# Altium schematic sheet Arduino_Uno_v1_schematic.SchDoc
size B; PageSetup: Record=PageOptions|CenterHorizontal=True|CenterVertical=True|PrintScale=1.54|XCorrection=1.00|YCorrection=1.00|PrintKind=1|BorderSize=5000000|LeftOffset=0|BottomOffset=0|Orientation=2|PaperLength=1000|PaperWidth=1000|Scale=100|PaperSource=7|PrintQuality=-3|MediaType=1|DitherType=10|PrintScaleMode=1|PaperKind=A3|PaperIndex=8
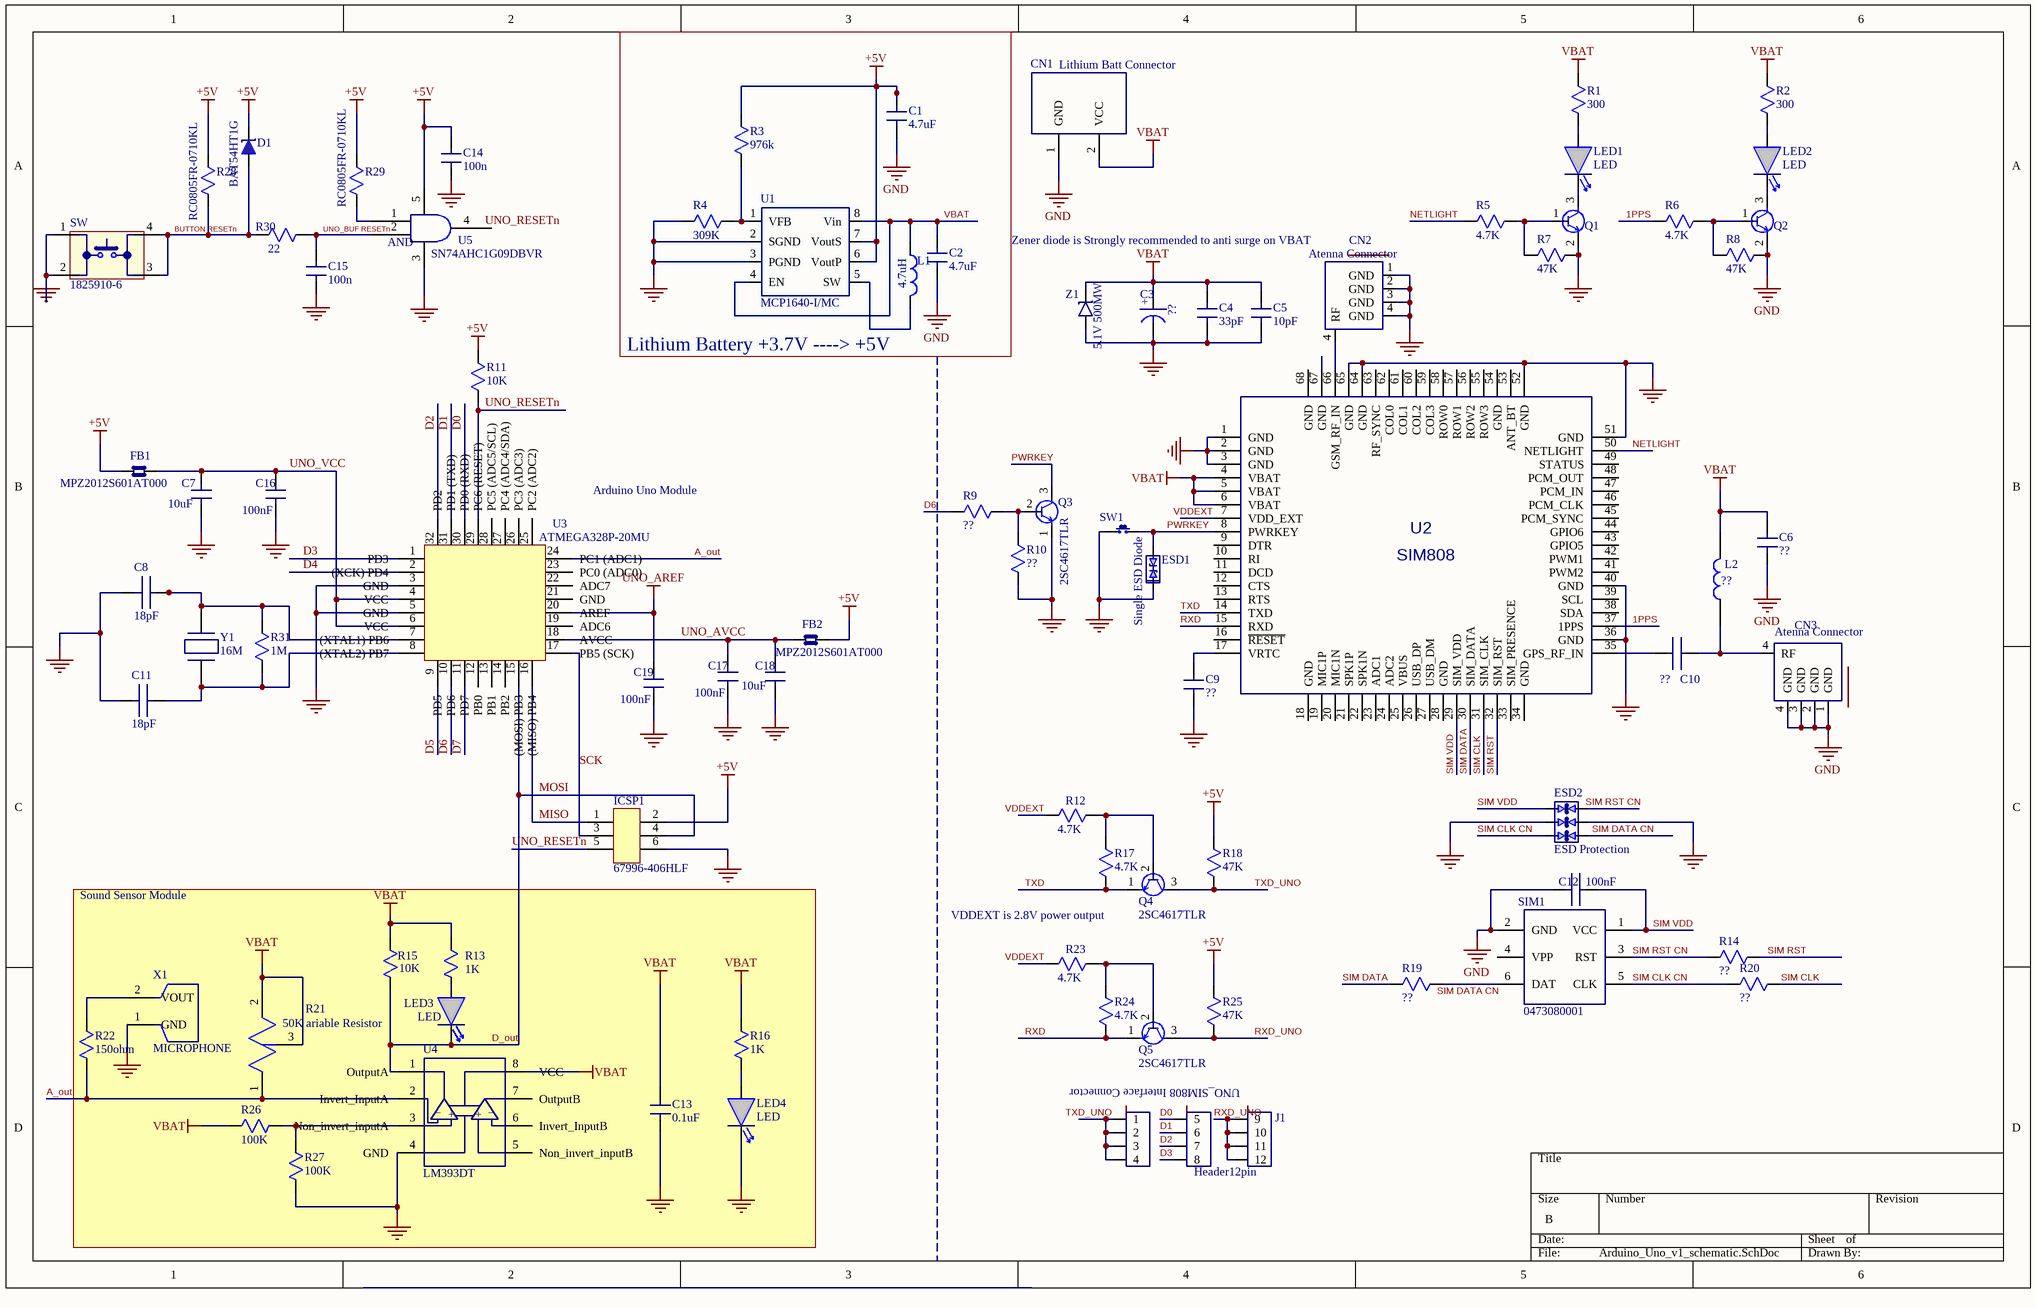
[diagram p0: Arduino_Uno_v1_schematic.SchDoc]

## Parts
C1  4.7uF
C2  4.7uF
C3  ??
C4  33pF
C5  10pF
C6  ??
C7  10uF
C8  18pF
C9  ??
C10  ??
C11  18pF
C12  100nF
C13  0.1uF
C14  100n
C15  100n
C16  100nF
C17  100nF
C18  10uF
C19  100nF
CN1  Lithium Batt Connector
CN2  Atenna Connector
CN3  Atenna Connector
D1  BAT54HT1G
ESD1  Single ESD Diode
ESD2  ESD Protection
FB1  MPZ2012S601AT000
FB2  MPZ2012S601AT000
ICSP1  67996-406HLF
J1  Header12pin
L1  4.7uH
L2  ??
LED1  LED
LED2  LED
LED3  LED
LED4  LED
Q1  TRANS NPN  (value not drawn)
Q2  TRANS NPN  (value not drawn)
Q3  2SC4617TLR
Q4  2SC4617TLR
Q5  2SC4617TLR
R1  300
R2  300
R3  976k
R4  309K
R5  4.7K
R6  4.7K
R7  47K
R8  47K
R9  ??
R10  ??
R11  10K
R12  4.7K
R13  1K
R14  ??
R15  10K
R16  1K
R17  4.7K
R18  47K
R19  ??
R20  ??
R21  50K ariable Resistor
R22  150ohm
R23  4.7K
R24  4.7K
R25  47K
R26  100K
R27  100K
R28  RC0805FR-0710KL
R29  RC0805FR-0710KL
R30  22
R31  1M
SIM1  0473080001
SW  1825910-6
SW1  SWITCH  (value not drawn)
U1  MCP1640-I/MC
U2  SIM808  [QFN100P2400X2400X260-68N]
U3  ATMEGA328P-20MU
U4  LM393DT
U5  SN74AHC1G09DBVR
X1  MICROPHONE
Y1  16M
Z1  5.1V 500MW

## Blocks framed on the sheet
Lithium Battery +3.7V ----> +5V: C1 C2 L1 R3 R4 U1
Sound Sensor Module: C13 LED3 LED4 R13 R15 R16 R21 R22 R26 R27 U4 X1

## Nets
+5V: C1.2 C14.2 D1.1(Cathode) FB1.1 FB2.1 ICSP1.2 R3.2 R11.1 R18.2 R25.2 R28.2 R29.2 U1.6(VoutP) U1.7(VoutS) U5.5
GND: C1.1 C2.1 C3.1 C4.1 C5.1 C6.1 C7.2 C8.1 C9.2 C11.1 C12.1 C13.1 C14.1 C15.1 C16.2 C17.2 C18.2 C19.2 CN1.1(GND) CN2.1(GND) CN2.2(GND) CN2.3(GND) CN2.4(GND) CN3.1(GND) CN3.2(GND) CN3.3(GND) CN3.4(GND) ESD1.1 ESD2.2 ESD2.5 ICSP1.6 LED4.2 Q1.2 Q2.2 Q3.1 R4.1 R7.2 R8.2 R10.2 R27.2 SIM1.2(GND) SW.1 SW.2 SW1.1 U1.2(SGND) U1.3(PGND) U2.1(GND) U2.2(GND) U2.3(GND) U2.36(GND) U2.40(GND) U2.51(GND) U2.52(GND) U2.64(GND) U2.65(GND) U5.3 X1.1(GND) Z1.1
UNO_AREF: C19.1
VBAT: C2.2 C3.2 C4.2 C5.2 C6.2 C13.2 CN1.2(VCC) L1.1 L2.1 R1.2 R2.2 R13.1 R15.1 R16.1 R21.2 R21.3 R26.1 U1.4(EN) U1.8(Vin) U2.4(VBAT) U2.5(VBAT) U2.6(VBAT) Z1.1
1PPS: R6.1 U2.37(1PPS)
A_out: R21.1 R22.2
BUTTON RESETn: D1.2(Anode) R28.1 R30.1 SW.3 SW.4
D0: J1.5
D1: J1.6
D2: J1.7
D3: J1.8
D6: R9.2
D_out: ICSP1.4 LED3.2 R15.2  [also labelled MOSI]
MISO: ICSP1.1(MISO)
NETLIGHT: R5.1 U2.50(NETLIGHT)
PWRKEY: ESD1.2 Q3.3 SW1.1 U2.8(PWRKEY)
RXD: Q5.1 R24.1 U2.15(RXD)
RXD_UNO: J1.9 J1.10 J1.11 J1.12 Q5.3 R25.1
SCK: ICSP1.3
SIM CLK: R20.1 U2.31(SIM_CLK)
SIM CLK CN: ESD2.6 R20.2 SIM1.5(CLK)
SIM DATA: R19.2 U2.30(SIM_DATA)
SIM DATA CN: ESD2.1
SIM RST: R14.1 U2.32(SIM_RST)
SIM RST CN: R14.2 SIM1.3(RST)
SIM VDD: C12.2 ESD2.4 SIM1.1(VCC) U2.29(SIM_VDD)
TXD: Q4.1 R17.1 U2.14(TXD)
TXD_UNO: Q4.3 R18.1
UNO_AVCC: C17.1 C18.1 FB2.2
UNO_BUF RESETn: C15.2 R30.2 U5.2
UNO_RESETn: ICSP1.5 R11.2
UNO_VCC: C7.1 C16.1 FB1.2
NetC8_2: C8.2 R31.2 Y1.1
NetC9_1: C9.1 U2.17(VRTC)
NetC10_1: C10.1 U2.35(GPS_RF_IN)
NetC10_2: C10.2 CN3.4(RF) L2.1
NetC11_2: C11.2 R31.1 Y1.2
NetCN2_4: CN2.4(RF) U2.66(GSM_RF_IN)
NetJ1_1: J1.1 J1.2 J1.3 J1.4
NetL1_2: L1.2 U1.5(SW)
NetLED1_1: LED1.1 R1.1
NetLED1_2: LED1.2 Q1.3
NetLED2_1: LED2.1 R2.1
NetLED2_2: LED2.2 Q2.3
NetLED3_1: LED3.1 R13.2
NetLED4_1: LED4.1 R16.2
NetQ1_1: Q1.1 R5.2 R7.1
NetQ2_1: Q2.1 R6.2 R8.1
NetQ3_2: Q3.2 R9.1 R10.1
NetQ4_2: Q4.2 R12.1 R17.2
NetQ5_2: Q5.2 R23.1 R24.2
NetR3_1: R3.1 R4.2 U1.1(VFB)
NetR19_1: R19.1 SIM1.6(DAT)
NetR22_1: R22.1 X1.2(VOUT)
NetR26_2: R26.2 R27.1
NetR29_1: R29.1 U5.1

Not connected (* = marked no-connect by the designer): ESD2 3; R12 2; R23 2; SIM1 4(VPP); U2 7(VDD_EXT) 9(DTR) 10(RI) 11(DCD) 12(CTS) 13(RTS) 16(~{RESET}) 18(GND) 19(MIC1P) 20(MIC1N) 21(SPK1P) 22(SPK1N) 23(ADC1) 24(ADC2) 25(VBUS) 26(USB_DP) 27(USB_DM) 28(GND) 33(SIM_PRESENCE) 34(GND) 38(SDA) 39(SCL) 41(PWM2) 42(PWM1) 43(GPIO5) 44(GPIO6) 45(PCM_SYNC) 46(PCM_CLK) 47(PCM_IN) 48(PCM_OUT) 49(STATUS) 53(ANT_BT) 54(GND) 55(ROW3) 56(ROW2) 57(ROW1) 58(ROW0) 59(COL3) 60(COL2) 61(COL1) 62(COL0) 63(RF_SYNC) 67(GND) 68(GND); U3 1(PD3) 2((XCK)_PD4) 3(GND) 4(VCC) 5(GND) 6(VCC) 7((XTAL1)_PB6) 8((XTAL2)_PB7) 9(PD5) 10(PD6) 11(PD7) 12(PB0) 13(PB1) 14(PB2) 15((MOSI)_PB3) 16((MISO)_PB4) 17(PB5_(SCK)) 18(AVCC) 19(ADC6) 20(AREF) 21(GND) 22(ADC7) 23(PC0_(ADC0)) 24(PC1_(ADC1)) 25(PC2_(ADC2)) 26(PC3_(ADC3)) 27(PC4_(ADC4/SDA)) 28(PC5_(ADC5/SCL)) 29(PC6_(RESET)) 30(PD0_(RXD)) 31(PD1_(TXD)) 32(PD2); U4 1(OutputA) 2(Invert_InputA) 3(Non_invert_inputA) 4(GND) 5(Non_invert_inputB) 6(Invert_InputB) 7(OutputB) 8(VCC); U5 4

## Notes on the sheet
- (near CN2) Zener diode is Strongly recommended to anti surge on VBAT
- (near U3) Arduino Uno Module
- VDDEXT is 2.8V power output
- (near J1) UNO_SIM808 Interface Connector
- Labels drawn without touching a wire or pin: SIM DATA CN, SIM RST CN, TXD_UNO, UNO_RESETn, VDDEXT
- (in symbol LM393DT) _; +
- (in symbol NOJA475M006RWJ) +
- (in symbol SN74AHC1G09DBVR) AND

## Library data of the parts
C1 C2 C4-C7 C9 C10 C12-C19 = Capacitor
C3 = NOJA475M006RWJ: CAP NIOB OXI 4.7UF 20% 6.3V 1206; Manufacturer: AVX Corporation; Manufacturer Size Code: A; Capacitance: 4.7µF; ESR (Equivalent Series Resistance): 3.2 Ohm; Current - Leakage: 1.1µA; Dissipation Factor: 6%; Supplier 1: Digi-Key; Manufacturer Part Number: NOJA475M006RWJ; RoHS: RoHS Compliant; Category: Capacitors; Stock 1: 9083; Pricing 1: 1=0.53, 10=0.376, 100=0.2478, 500=0.18354, 1000=0.15601 (USD); Packaging: Cut Tape (CT); Part Status: Active; Tolerance: ±20%; Voltage - Rated: 6.3V; Mounting Type: Surface Mount; Package / Case: 1206 (3216 Metric); Height - Seated (Max): 0.071" (1.80mm); Features: -; Operating Temperature: -55°C ~ 105°C; Supplier Device Package: 1206 (3216 Metric); Size / Dimension: 0.126" L x 0.063" W (3.20mm x 1.60mm); ComponentLink1URL: http://datasheets.avx.com/NOJ.pdf; ComponentLink1Description: http://datasheets.avx.com/NOJ.pdf; Supplier Part Number 1: 478-3213-1-ND
C8 C11 = C0805C180J5GACTU: CAP CER 18PF 50V C0G/NP0 0805; Manufacturer: KEMET; Tolerance: ±5%; Temperature Coefficient: C0G, NP0; Supplier 1: Digi-Key; Manufacturer Part Number: C0805C180J5GACTU; RoHS: RoHS Compliant; Category: Capacitors; Stock 1: 179478; Pricing 1: 1=0.11, 10=0.076, 100=0.0357, 500=0.02504, 1000=0.02073 (USD); Packaging: Cut Tape (CT); Part Status: Active; Capacitance: 18pF; Voltage - Rated: 50V; Operating Temperature: -55°C ~ 125°C; Features: Low ESL; Ratings: -; Applications: General Purpose; Failure Rate: -; Mounting Type: Surface Mount, MLCC; Package / Case: 0805 (2012 Metric); Size / Dimension: 0.079" L x 0.049" W (2.00mm x 1.25mm); Height - Seated (Max): -; Thickness (Max): 0.035" (0.88mm); Lead Spacing: -; Lead Style: -; ComponentLink1URL: http://www.kemet.com/docfinder?Partnumber=C0805C180J5GACTU; ComponentLink1Description: http://www.kemet.com/docfinder?Partnumber=C0805C180J5GACTU; Supplier Part Number 1: 399-1112-1-ND
CN1 = PHR-2: CONN HOUSING PH 2POS 2MM WHITE; Manufacturer: JST Sales America Inc.; Connector Type: Receptacle; Number of Positions: 2; Pitch: 0.079" (2.00mm); Contact Termination: Crimp; Note: Contacts Not Included; Supplier 1: Digi-Key; Manufacturer Part Number: PHR-2; RoHS: RoHS Compliant; Category: Connectors, Interconnects; Stock 1: 288735; Pricing 1: 1=0.1, 10=0.078, 25=0.0584, 50=0.05, 100=0.0484, 250=0.04172, 500=0.04004, 1000=0.03503, 2500=0.03169 (USD); Packaging: Bulk; Part Status: Active; Contact Type: Female Socket; Number of Rows: 1; Row Spacing: -; Mounting Type: Free Hanging (In-Line); Fastening Type: Detent Lock; Color: Natural; Features: -; ComponentLink1URL: http://www.jst-mfg.com/product/pdf/eng/ePH.pdf; ComponentLink1Description: http://www.jst-mfg.com/product/pdf/eng/ePH.pdf; Supplier Part Number 1: 455-1165-ND
D1 = BAT54HT1G: DIODE SCHOTTKY 30V 200MA SOD323; Manufacturer: ON Semiconductor; Current - Average Rectified (Io): 200mA (DC); Voltage - Forward (Vf) (Max) @ If: 800mV @ 100mA; Speed: Small Signal =< 200mA (Io), Any Speed; Current - Reverse Leakage @ Vr: 2µA @ 25V; Capacitance @ Vr, F: 10pF @ 1V, 1MHz; Supplier 1: Digi-Key; Manufacturer Part Number: BAT54HT1G; RoHS: RoHS Compliant; Category: Discrete Semiconductor Products; Stock 1: 90000; Pricing 1: 3000=0.05237, 6000=0.04554, 15000=0.03871, 30000=0.03643, 75000=0.03416, 150000=0.0296 (USD); Packaging: Tape & Reel (TR); Part Status: Active; Diode Type: Schottky; Voltage - DC Reverse (Vr) (Max): 30V; Mounting Type: Surface Mount; Package / Case: SC-76, SOD-323; Supplier Device Package: SOD-323; Operating Temperature - Junction: -55°C ~ 150°C; ComponentLink1URL: http://www.onsemi.com/pub_link/Collateral/BAT54HT1-D.PDF; ComponentLink1Description: http://www.onsemi.com/pub_link/Collateral/BAT54HT1-D.PDF; Supplier Part Number 1: BAT54HT1GOSTR-ND
ESD1 = VCUT0714A-HD1-GS08: TVS DIODE 7VWM/14VWM LLP10062L; Manufacturer: Vishay Semiconductor Diodes Division; Voltage - Reverse Standoff (Typ): 7V, 14V; Voltage - Breakdown (Min): 7.3V, 14.5V; Voltage - Clamping (Max) @ Ipp: 17V, 30V; Current - Peak Pulse (10/1000µs): 5A, 2A (8/20µs); Power - Peak Pulse: 54W, 63W; Power Line Protection: No; Capacitance @ Frequency: 8pF @ 1MHz; Supplier 1: Digi-Key; Manufacturer Part Number: VCUT0714A-HD1-GS08; RoHS: RoHS Compliant; Category: Circuit Protection; Stock 1: 56000; Pricing 1: 8000=0.0756, 16000=0.0672, 24000=0.063, 56000=0.05586 (USD); Packaging: Tape & Reel (TR); Part Status: Active; Type: Zener; Applications: General Purpose; Operating Temperature: -40°C ~ 125°C (TJ); Mounting Type: Surface Mount; Package / Case: SOD-882; Supplier Device Package: LLP1006-2L; ComponentLink1URL: http://www.vishay.com/docs/81801/vcut0714.pdf; ComponentLink1Description: http://www.vishay.com/docs/81801/vcut0714.pdf; Supplier Part Number 1: 751-1449-2-ND
ESD2 = RSB16X3NTR: TVS DIODE 12VWM UMD6; Manufacturer: Rohm Semiconductor; Voltage - Reverse Standoff (Typ): 12V; Voltage - Breakdown (Min): 14.4V; Power Line Protection: No; Capacitance @ Frequency: 30pF @ 1MHz; Supplier 1: Digi-Key; Manufacturer Part Number: RSB16X3NTR; RoHS: RoHS Compliant; Category: Circuit Protection; Stock 1: 0; Pricing 1: 3000=0.14956 (USD); Packaging: Tape & Reel (TR); Part Status: Active; Type: Zener; Voltage - Clamping (Max) @ Ipp: -; Current - Peak Pulse (10/1000µs): -; Power - Peak Pulse: -; Applications: General Purpose; Operating Temperature: -; Mounting Type: Surface Mount; Package / Case: 6-TSSOP, SC-88, SOT-363; Supplier Device Package: UMD6; ComponentLink1URL: http://rohmfs.rohm.com/en/products/databook/datasheet/discrete/diode/zener/rsb16x3n.pdf; ComponentLink1Description: http://rohmfs.rohm.com/en/products/databook/datasheet/discrete/diode/zener/rsb16x3n.pdf; Supplier Part Number 1: RSB16X3NTR-ND
FB1 FB2 = MPZ2012S601AT000: FERRITE BEAD 600 OHM 0805 1LN; Manufacturer: TDK Corporation; Filter Type: Power Line; Number of Lines: 1; Impedance @ Frequency: 600 Ohm @ 100MHz; Current Rating (Max): 2A; DC Resistance (DCR) (Max): 100 mOhm; Supplier 1: Digi-Key; Manufacturer Part Number: MPZ2012S601AT000; RoHS: RoHS Compliant; Category: Filters; Stock 1: 366929; Pricing 1: 1=0.11, 10=0.091, 25=0.0704, 50=0.0584, 100=0.0503, 250=0.04028, 500=0.03624, 1000=0.0302 (USD); Packaging: Cut Tape (CT); Part Status: Active; Ratings: -; Operating Temperature: -55°C ~ 125°C; Package / Case: 0805 (2012 Metric); Mounting Type: Surface Mount; Height (Max): 0.041" (1.05mm); Size / Dimension: 0.079" L x 0.049" W (2.00mm x 1.25mm); ComponentLink1URL: https://product.tdk.com/info/en/catalog/datasheets/beads_commercial_power_mpz2012_en.pdf; ComponentLink1Description: https://product.tdk.com/info/en/catalog/datasheets/beads_commercial_power_mpz2012_en.pdf; Supplier Part Number 1: 445-2206-1-ND
ICSP1 = 67996-406HLF: CONN HEADER 6POS .100 STR TIN; Manufacturer: Amphenol FCI; Pitch - Mating: 0.100" (2.54mm); Style: Board to Board; Shrouding: Unshrouded; Number of Positions: 6; Number of Positions Loaded: All; Contact Length - Mating: 0.230" (5.84mm); Contact Length - Post: 0.095" (2.41mm); Overall Contact Length: 0.425" (10.80mm); Material Flammability Rating: UL94 V-0; Supplier 1: Digi-Key; Manufacturer Part Number: 67996-406HLF; RoHS: RoHS Compliant; Category: Connectors, Interconnects; Stock 1: 18877; Pricing 1: 1=0.27, 10=0.258, 100=0.1803, 500=0.15456, 1000=0.1288, 5000=0.1104, 10000=0.10304 (USD); Packaging: Bulk; Part Status: Active; Connector Type: Header; Contact Type: Male Pin; Number of Rows: 2; Row Spacing - Mating: 0.100" (2.54mm); Mounting Type: Through Hole; Termination: Solder; Fastening Type: -; Insulation Height: 0.100" (2.54mm); Contact Shape: Square; Contact Finish - Mating: Tin; Contact Finish Thickness - Mating: 100µin (2.54µm); Contact Finish - Post: Tin; Contact Material: Phosphor Bronze; Insulation Material: -; Features: -; Operating Temperature: -; Ingress Protection: -; Insulation Color: Black; Current Rating: -; Voltage Rating: -; Mated Stacking Heights: -; Contact Finish Thickness - Post: -; Applications: -; ComponentLink1URL: http://portal.fciconnect.com/Comergent//fci/drawing/67996.pdf; ComponentLink1Description: http://portal.fciconnect.com/Comergent//fci/drawing/67996.pdf; Supplier Part Number 1: 609-3218-ND
J1 = Header12pin: Software UART Jumper
L1 L2 = BLM21PG221SN1D: FERRITE BEAD 220 OHM 0805 1LN; Manufacturer: Murata Electronics North America; Filter Type: Power Line; Number of Lines: 1; Impedance @ Frequency: 220 Ohm @ 100MHz; Current Rating (Max): 2A; DC Resistance (DCR) (Max): 45 mOhm; Supplier 1: Digi-Key; Manufacturer Part Number: BLM21PG221SN1D; RoHS: RoHS Compliant; Category: Filters; Stock 1: 897655; Pricing 1: 1=0.1, 10=0.081, 25=0.0732, 50=0.0538, 100=0.0464, 250=0.03664, 500=0.03094, 1000=0.02605 (USD); Packaging: Cut Tape (CT); Part Status: Active; Ratings: -; Operating Temperature: -55°C ~ 125°C; Package / Case: 0805 (2012 Metric); Mounting Type: Surface Mount; Height (Max): 0.041" (1.05mm); Size / Dimension: 0.079" L x 0.049" W (2.00mm x 1.25mm); ComponentLink1URL: http://www.murata.com/en-us/products/productdata/8796738977822/ENFA0005.pdf; ComponentLink1Description: http://www.murata.com/en-us/products/productdata/8796738977822/ENFA0005.pdf; Supplier Part Number 1: 490-1054-1-ND
Q1 Q2 = MMBT2222ALT1G: TRANS NPN 40V 0.6A SOT23; Manufacturer: ON Semiconductor; Current - Collector (Ic) (Max): 600mA; Vce Saturation (Max) @ Ib, Ic: 1V @ 50mA, 500mA; Current - Collector Cutoff (Max): 10nA (ICBO); DC Current Gain (hFE) (Min) @ Ic, Vce: 100 @ 150mA, 10V; Power - Max: 225mW; Frequency - Transition: 300MHz; Supplier 1: Digi-Key; Manufacturer Part Number: MMBT2222ALT1G; RoHS: RoHS Compliant; Category: Discrete Semiconductor Products; Stock 1: 786000; Pricing 1: 3000=0.01913, 6000=0.01726, 15000=0.015, 30000=0.0135, 75000=0.012, 150000=0.00998 (USD); Packaging: Tape & Reel (TR); Part Status: Active; Transistor Type: NPN; Voltage - Collector Emitter Breakdown (Max): 40V; Operating Temperature: -55°C ~ 150°C (TJ); Mounting Type: Surface Mount; Package / Case: TO-236-3, SC-59, SOT-23-3; Supplier Device Package: SOT-23; ComponentLink1URL: http://www.onsemi.com/pub_link/Collateral/MMBT2222LT1-D.PDF; ComponentLink1Description: http://www.onsemi.com/pub_link/Collateral/MMBT2222LT1-D.PDF; Supplier Part Number 1: MMBT2222ALT1GOSTR-ND
Q3-Q5 = 2SC4617TLR: TRANS NPN 50V 0.15A SOT-416; Manufacturer: Rohm Semiconductor; Current - Collector (Ic) (Max): 150mA; Vce Saturation (Max) @ Ib, Ic: 400mV @ 5mA, 50mA; Current - Collector Cutoff (Max): 100nA (ICBO); DC Current Gain (hFE) (Min) @ Ic, Vce: 180 @ 1mA, 6V; Power - Max: 150mW; Frequency - Transition: 180MHz; Supplier 1: Digi-Key; Manufacturer Part Number: 2SC4617TLR; RoHS: RoHS Compliant; Category: Discrete Semiconductor Products; Stock 1: 15000; Pricing 1: 3000=0.05313, 6000=0.0462, 15000=0.03927, 30000=0.03696, 75000=0.03465, 150000=0.03003 (USD); Packaging: Tape & Reel (TR); Part Status: Active; Transistor Type: NPN; Voltage - Collector Emitter Breakdown (Max): 50V; Operating Temperature: 150°C (TJ); Mounting Type: Surface Mount; Package / Case: SC-75, SOT-416; Supplier Device Package: EMT3; ComponentLink1URL: http://rohmfs.rohm.com/en/products/databook/datasheet/discrete/transistor/bipolar/2sc2412kt146q-e.pdf; ComponentLink1Description: http://rohmfs.rohm.com/en/products/databook/datasheet/discrete/transistor/bipolar/2sc2412kt146q-e.pdf; Supplier Part Number 1: 2SC4617TLRTR-ND
R1-R20 R22-R27 R30 = Resistor
R21 = P0915N-FC15BR10K: POT 10K OHM 1/20W PLASTIC LINEAR; Manufacturer: TT Electronics/BI; Tolerance: ±20%; Built in Switch: None; Power (Watts): 0.05W, 1/20W; Number of Turns: 1; Rotation: 300°; Adjustment Type: Top Adjustment; Resistive Material: Conductive Plastic; Actuator Type: Flatted; Actuator Length: 0.591" (15.00mm); Actuator Diameter: 0.236" (6.00mm); Bushing Thread: M7 x 0.75; Supplier 1: Digi-Key; Manufacturer Part Number: P0915N-FC15BR10K; RoHS: RoHS Compliant; Category: Potentiometers, Variable Resistors; Stock 1: 35991; Pricing 1: 1=1.29, 10=1.14, 25=1.026, 50=0.988, 100=0.95, 250=0.893, 500=0.76, 1000=0.703, 5000=0.5776 (USD); Packaging: Tray; Part Status: Active; Taper: Linear; Resistance (Ohms): 10k; Temperature Coefficient: -; Termination Style: PC Pins, Board Locks; Mounting Type: Panel Mount; ComponentLink1URL: http://www.ttelectronics.com/sites/default/files/download-files/Datasheet_PanelPot_P09xSeries.pdf; ComponentLink1Description: http://www.ttelectronics.com/sites/default/files/download-files/Datasheet_PanelPot_P09xSeries.pdf; Supplier Part Number 1: 987-1649-ND
R28 R29 = RC0805FR-0710KL: RES SMD 10K OHM 1% 1/8W 0805; Manufacturer: Yageo; Power (Watts): 0.125W, 1/8W; Temperature Coefficient: ±100ppm/°C; Supplier 1: Digi-Key; Manufacturer Part Number: RC0805FR-0710KL; RoHS: RoHS Compliant; Category: Resistors; Stock 1: 6469211; Pricing 1: 1=0.1, 10=0.021, 100=0.0084, 1000=0.00379, 2500=0.00329 (USD); Packaging: Cut Tape (CT); Part Status: Active; Resistance (Ohms): 10k; Tolerance: ±1%; Composition: Thick Film; Features: Moisture Resistant; Operating Temperature: -55°C ~ 155°C; Package / Case: 0805 (2012 Metric); Supplier Device Package: 0805; Size / Dimension: 0.079" L x 0.049" W (2.00mm x 1.25mm); Height - Seated (Max): 0.024" (0.60mm); Failure Rate: -; ComponentLink1URL: http://www.yageo.com/documents/recent/PYu-RC_Group_51_RoHS_L_7.pdf; ComponentLink1Description: http://www.yageo.com/documents/recent/PYu-RC_Group_51_RoHS_L_7.pdf; Supplier Part Number 1: 311-10.0KCRCT-ND
R31 = RC0805FR-071ML: RES SMD 1M OHM 1% 1/8W 0805; Manufacturer: Yageo; Power (Watts): 0.125W, 1/8W; Temperature Coefficient: ±100ppm/°C; Supplier 1: Digi-Key; Manufacturer Part Number: RC0805FR-071ML; RoHS: RoHS Compliant; Category: Resistors; Stock 1: 932446; Pricing 1: 1=0.1, 10=0.021, 100=0.0084, 1000=0.00379, 2500=0.00329 (USD); Packaging: Cut Tape (CT); Part Status: Active; Resistance (Ohms): 1M; Tolerance: ±1%; Composition: Thick Film; Features: Moisture Resistant; Operating Temperature: -55°C ~ 155°C; Package / Case: 0805 (2012 Metric); Supplier Device Package: 0805; Size / Dimension: 0.079" L x 0.049" W (2.00mm x 1.25mm); Height - Seated (Max): 0.024" (0.60mm); Failure Rate: -; ComponentLink1URL: http://www.yageo.com/documents/recent/PYu-RC_Group_51_RoHS_L_7.pdf; ComponentLink1Description: http://www.yageo.com/documents/recent/PYu-RC_Group_51_RoHS_L_7.pdf; Supplier Part Number 1: 311-1.00MCRCT-ND
SIM1 = 0473080001: CONN SIM CARD PUSH-PULL R/A SMD; Manufacturer: Molex, LLC; Number of Positions: 6; Connector Type: Connector; Insertion, Removal Method: Push In, Pull Out; Supplier 1: Digi-Key; Manufacturer Part Number: 0473080001; RoHS: RoHS Compliant; Category: Connectors, Interconnects; Stock 1: 12000; Pricing 1: 1000=0.2772, 2000=0.2688, 3000=0.252, 5000=0.2436, 10000=0.2268, 25000=0.2184 (USD); Packaging: Tape & Reel (TR); Part Status: Active; Card Type: SIM Card; Ejector Side: -; Mounting Type: Surface Mount, Right Angle; Features: -; Height Above Board: 0.079" (2.00mm); Mounting Feature: Normal, Standard - Top; Contact Finish: Gold; Contact Finish Thickness: 19.7µin (0.50µm); ComponentLink1URL: http://www.molex.com/pdm_docs/sd/473080001_sd.pdf; ComponentLink1Description: http://www.molex.com/pdm_docs/sd/473080001_sd.pdf; Supplier Part Number 1: WM6699TR-ND
SW = 1825910-6: SWITCH TACTILE SPST-NO 0.05A 24V; Manufacturer: TE Connectivity ALCOSWITCH Switches; Switch Function: Off-Mom; Contact Rating @ Voltage: 0.05A @ 24VDC; Actuator Type: Standard; Actuator Height off PCB, Vertical: 5.00mm; Actuator Orientation: Top Actuated; Outline: 6.00mm x 6.00mm; Illumination: Non-Illuminated; Operating Force: 160gf; Actuator Material: Polybutylene Terephthalate (PBT); Switch Travel: 0.25mm; Mechanical Life: 100,000 Cycles; Supplier 1: Digi-Key; Manufacturer Part Number: 1825910-6; RoHS: RoHS Compliant; Category: Switches; Stock 1: 99237; Pricing 1: 1=0.1, 10=0.088, 25=0.0856, 50=0.0824, 100=0.0778, 250=0.07324, 500=0.07018, 1000=0.0534, 5000=0.04425 (USD); Packaging: Bulk; Part Status: Active; Circuit: SPST-NO; Mounting Type: Through Hole; Actuator Length, Right Angle: -; Termination Style: PC Pin; Illumination Type, Color: -; Illumination Voltage (Nominal): -; Ingress Protection: -; Features: -; Operating Temperature: -35°C ~ 85°C; ComponentLink1URL: http://www.te.com/commerce/DocumentDelivery/DDEController?Action=srchrtrv&DocNm=1825910&DocType=Customer+Drawing&DocLang=English; ComponentLink1Description: http://www.te.com/commerce/DocumentDelivery/DDEController?Action=srchrtrv&DocNm=1825910&DocType=Customer+Drawing&DocLang=English; Supplier Part Number 1: 450-1650-ND
U1 = MCP1640-I/MC: IC REG BOOST ADJ 0.35A SYNC 8DFN; Manufacturer: Microchip Technology; Function: Step-Up; Output Configuration: Positive; Output Type: Adjustable; Number of Outputs: 1; Voltage - Input (Min): 0.8V; Voltage - Input (Max): 5.5V; Voltage - Output (Min/Fixed): 2V; Current - Output: 350mA; Frequency - Switching: 500kHz; Synchronous Rectifier: Yes; Supplier 1: Digi-Key; Manufacturer Part Number: MCP1640-I/MC; RoHS: RoHS Compliant; Category: Integrated Circuits (ICs); Stock 1: 0; Pricing 1: 1=0.63, 25=0.5152, 100=0.4738 (USD); Packaging: Tube; Part Status: Active; Topology: Boost; Voltage - Output (Max): 5.5V; Operating Temperature: -40°C ~ 125°C (TJ); Mounting Type: Surface Mount; Package / Case: 8-VFDFN Exposed Pad; Supplier Device Package: 8-DFN (3x2); ComponentLink1URL: http://www.microchip.com/mymicrochip/filehandler.aspx?ddocname=en547085; ComponentLink1Description: http://www.microchip.com/mymicrochip/filehandler.aspx?ddocname=en547085; Supplier Part Number 1: MCP1640-I/MC-ND
U2 = SIM808: Module: GPS/GSM; GPRS; 2G; 1800MHz, 900MHz; GPIO, Serial, USB; SMD; MF: Simcom; Package: None; MP: SIM808; Availability: Unavailable; Price: 17.19 USD; Value: *
U3 = ATMEGA328P-20MU: IC MCU 8BIT 32KB FLASH 32SMD; Manufacturer: Microchip Technology; Manufacturer Part Number: ATMEGA328P-PU; Core Processor: AVR; Core Size: 8-Bit; Speed: 20MHz; Connectivity: I²C, SPI, UART/USART; Peripherals: Brown-out Detect/Reset, POR, PWM, WDT; Number of I/O: 23; Program Memory Size: 32KB (16K x 16); EEPROM Size: 1K x 8; RAM Size: 2K x 8; Voltage - Supply (Vcc/Vdd): 1.8 V ~ 5.5 V; Data Converters: A/D 6x10b; Oscillator Type: Internal; Supplier 1: Digi-Key; RoHS: RoHS Compliant; Category: Integrated Circuits (ICs); Stock 1: 17084; Pricing 1: 1=2.14, 25=1.9672, 100=1.7819 (USD); Packaging: Tube; Part Status: Active; Program Memory Type: FLASH; Operating Temperature: -40°C ~ 85°C (TA); Package / Case: 28-DIP (0.300", 7.62mm); Supplier Device Package: 28-PDIP; ComponentLink1URL: http://www.atmel.com/images/atmel-8271-8-bit-avr-microcontroller-atmega48a-48pa-88a-88pa-168a-168pa-328-328p_datasheet_summary.pdf; ComponentLink1Description: http://www.atmel.com/images/atmel-8271-8-bit-avr-microcontroller-atmega48a-48pa-88a-88pa-168a-168pa-328-328p_datasheet_summary.pdf; Supplier Part Number 1: ATMEGA328P-PU-ND
U4 = LM393DT: IC COMPARATOR LP DUAL 8-SOIC; Manufacturer: STMicroelectronics; Output Type: CMOS, DTL, ECL, MOS, Open-Collector, TTL; Voltage - Supply, Single/Dual (±): 2 V ~ 36 V, ±1 V ~ 18 V; Voltage - Input Offset (Max): 5mV @ 30V; Current - Input Bias (Max): 0.25µA @ 5V; Current - Output (Typ): 18mA @ 5V; Current - Quiescent (Max): 2.5mA; Supplier 1: Digi-Key; Manufacturer Part Number: LM393DT; RoHS: RoHS Compliant; Category: Integrated Circuits (ICs); Stock 1: 28706; Pricing 1: 1=0.39, 10=0.295, 100=0.184, 500=0.12586, 1000=0.09682 (USD); Packaging: Cut Tape (CT); Part Status: Active; Type: General Purpose; CMRR, PSRR (Typ): -; Propagation Delay (Max): -; Hysteresis: -; Operating Temperature: 0°C ~ 70°C; Package / Case: 8-SOIC (0.154", 3.90mm Width); Mounting Type: Surface Mount; Supplier Device Package: 8-SO; ComponentLink1URL: http://www.st.com/content/ccc/resource/technical/document/datasheet/group1/b4/cc/cf/13/18/28/44/f5/CD00000465/files/CD00000465.pdf/jcr:content/translations/en.CD00000465.pdf; ComponentLink1Description: http://www.st.com/content/ccc/resource/technical/document/datasheet/group1/b4/cc/cf/13/18/28/44/f5/CD00000465/files/CD00000465.pdf/jcr:content/translations/en.CD00000465.pdf; Supplier Part Number 1: 497-1593-1-ND
U5 = SN74AHC1G09DBVR: IC GATE AND 1CH 2-INP SOT-23-5; Manufacturer: Texas Instruments; Logic Type: AND Gate; Number of Circuits: 1; Number of Inputs: 2; Voltage - Supply: 2 V ~ 5.5 V; Current - Quiescent (Max): 1µA; Current - Output High, Low: -, 8mA; Logic Level - Low: 0.5 V ~ 1.65 V; Logic Level - High: 1.5 V ~ 3.85 V; Max Propagation Delay @ V, Max CL: 7.5ns @ 5V, 50pF; Supplier 1: Digi-Key; Manufacturer Part Number: SN74AHC1G09DBVR; RoHS: RoHS Compliant; Category: Integrated Circuits (ICs); Stock 1: 20159; Pricing 1: 1=0.42, 10=0.314, 100=0.1957, 500=0.1339, 1000=0.103 (USD); Packaging: Cut Tape (CT); Part Status: Active; Features: Open Drain; Operating Temperature: -55°C ~ 125°C; Mounting Type: Surface Mount; Supplier Device Package: SOT-23-5; Package / Case: SC-74A, SOT-753; ComponentLink1URL: http://www.ti.com/lit/ds/symlink/sn74ahc1g09.pdf; ComponentLink1Description: http://www.ti.com/lit/ds/symlink/sn74ahc1g09.pdf; Supplier Part Number 1: 296-29202-1-ND
X1 = CMA-4544PF-W: MIC COND ANALOG OMNI -44DB; Manufacturer: CUI Inc.; Direction: Omnidirectional; Frequency Range: 20Hz ~ 20kHz; Sensitivity: -44dB ±2dB @ 94dB SPL; S/N Ratio: 60dB; Impedance: 2.2 kOhm; Voltage Range: 3 ~ 10V; Current - Supply: 500µA; Port Location: Top; Shape: Circular; Supplier 1: Digi-Key; Manufacturer Part Number: CMA-4544PF-W; RoHS: RoHS Compliant; Category: Audio Products; Stock 1: 40210; Pricing 1: 1=0.82, 10=0.708, 25=0.5692, 50=0.506, 100=0.4428, 250=0.43012, 500=0.41746, 1000=0.3795, 5000=0.34155 (USD); Packaging: Bulk; Part Status: Active; Type: Electret Condenser; Output Type: Analog; Voltage - Rated: -; Termination: PC Pins; Size / Dimension: 0.382" Dia (9.70mm); Height (Max): 0.183" (4.65mm); ComponentLink1URL: http://www.cui.com/product/resource/digikeypdf/cma-4544pf-w.pdf; ComponentLink1Description: http://www.cui.com/product/resource/digikeypdf/cma-4544pf-w.pdf; Supplier Part Number 1: 102-1721-ND
Y1 = ASDM1-16.000MHZ-LC-T: OSC MEMS 16.000MHZ CMOS SMD; Manufacturer: Abracon LLC; Frequency: 16MHz; Function: Standby (Power Down); Output: LVCMOS; Voltage - Supply: 3.3V; Frequency Stability: ±50ppm; Current - Supply (Max): 10mA; Current - Supply (Disable) (Max): 10µA; Supplier 1: Digi-Key; Manufacturer Part Number: ASDM1-16.000MHZ-LC-T; RoHS: RoHS Compliant; Category: Crystals, Oscillators, Resonators; Stock 1: 1000; Pricing 1: 1000=1.1505, 3000=1.092, 5000=1.053 (USD); Packaging: Tape & Reel (TR); Part Status: Active; Type: MEMS (Silicon); Operating Temperature: -40°C ~ 85°C; Ratings: -; Mounting Type: Surface Mount; Package / Case: 4-SMD, No Lead; Size / Dimension: 0.098" L x 0.079" W (2.50mm x 2.00mm); Height - Seated (Max): 0.035" (0.90mm); ComponentLink1URL: http://www.abracon.com/Oscillators/ASDM.pdf; ComponentLink1Description: http://www.abracon.com/Oscillators/ASDM.pdf; Supplier Part Number 1: 535-9787-2-ND
Z1 = SZMMSZ5231BT1G: DIODE ZENER 500MW 5.1V SOD123; Manufacturer: ON Semiconductor; Tolerance: ±5%; Current - Reverse Leakage @ Vr: 5µA @ 2V; Voltage - Forward (Vf) (Max) @ If: 900mV @ 10mA; Supplier 1: Digi-Key; Manufacturer Part Number: SZMMSZ5231BT1G; RoHS: RoHS Compliant; Category: Discrete Semiconductor Products; Stock 1: 0; Pricing 1: 3000=0.066, 6000=0.0594, 15000=0.0528, 30000=0.0495, 75000=0.04389, 150000=0.04224 (USD); Packaging: Tape & Reel (TR); Part Status: Active; Power - Max: 500mW; Operating Temperature: -55°C ~ 150°C; Mounting Type: Surface Mount; Package / Case: SOD-123; Supplier Device Package: SOD-123; ComponentLink1URL: http://www.onsemi.com/pub_link/Collateral/MMSZ5221BT1-D.PDF; ComponentLink1Description: http://www.onsemi.com/pub_link/Collateral/MMSZ5221BT1-D.PDF; Supplier Part Number 1: SZMMSZ5231BT1GOSTR-ND